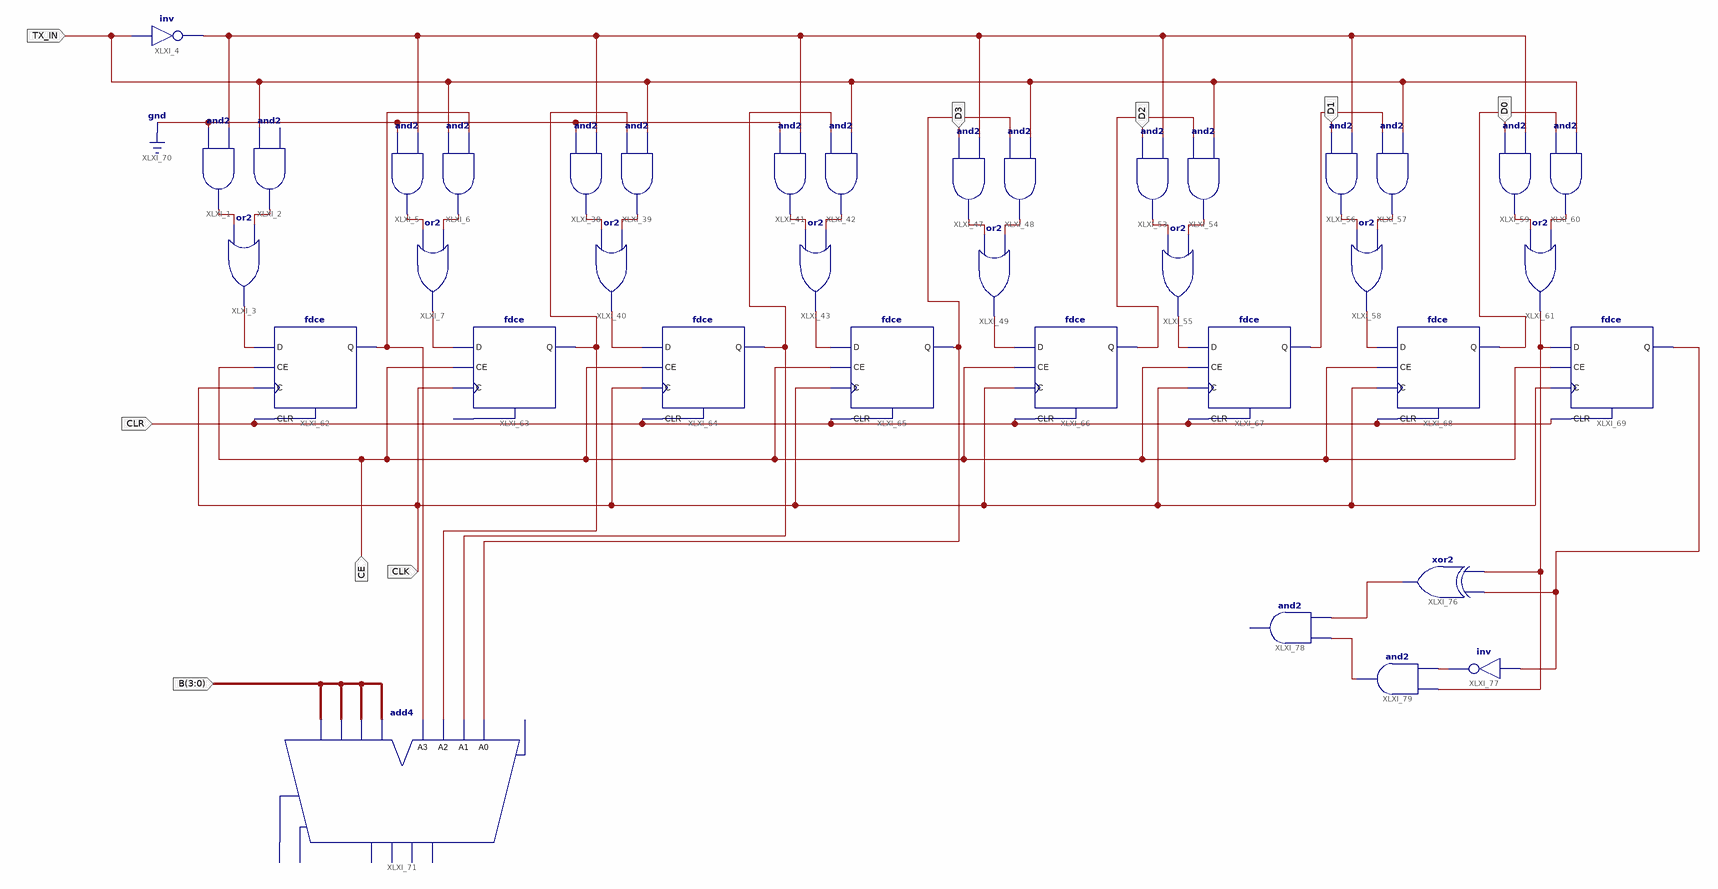
[diagram p0: schematic sheet 1]
// Xilinx ISE schematic Logic_CKT.sch (spartan3e) as structural Verilog: 38 symbols, 9 ports
module Logic_CKT (
  input  TX_IN,
  input  CLK,
  input  D0,
  input  D1,
  input  D2,
  input  D3,
  input  CE,
  input  [3:0] B,
  input  CLR
);

  wire XLXN_1, XLXN_2, XLXN_4, XLXN_5, XLXN_6, XLXN_7, XLXN_8, XLXN_9, XLXN_10, XLXN_11, XLXN_12, XLXN_13,
       XLXN_14, XLXN_15, XLXN_16, XLXN_17, XLXN_18, XLXN_19, XLXN_20, XLXN_21, XLXN_22, XLXN_23, XLXN_24,
       XLXN_25, XLXN_26, XLXN_27, XLXN_33, XLXN_57, XLXN_58, XLXN_59, XLXN_60, XLXN_61, XLXN_84, XLXN_85,
       XLXN_86, XLXN_87;

  and XLXI_1 (XLXN_1, 1'b0, XLXN_33);
  buf XLXI_2 (XLXN_2, TX_IN);  // and2 open: I1
  or XLXI_3 (XLXN_4, XLXN_1, XLXN_2);
  not XLXI_4 (XLXN_33, TX_IN);
  and XLXI_5 (XLXN_5, 1'b0, XLXN_33);
  and XLXI_6 (XLXN_6, TX_IN, XLXN_8);
  or XLXI_7 (XLXN_7, XLXN_5, XLXN_6);
  and XLXI_38 (XLXN_9, 1'b0, XLXN_33);
  and XLXI_39 (XLXN_10, XLXN_11, TX_IN);
  or XLXI_40 (XLXN_61, XLXN_9, XLXN_10);
  and XLXI_41 (XLXN_12, 1'b0, XLXN_33);
  and XLXI_42 (XLXN_13, XLXN_14, TX_IN);
  or XLXI_43 (XLXN_60, XLXN_12, XLXN_13);
  and XLXI_47 (XLXN_15, D3, XLXN_33);
  and XLXI_48 (XLXN_16, XLXN_23, TX_IN);
  or XLXI_49 (XLXN_58, XLXN_15, XLXN_16);
  and XLXI_53 (XLXN_17, D2, XLXN_33);
  and XLXI_54 (XLXN_18, XLXN_24, TX_IN);
  or XLXI_55 (XLXN_59, XLXN_17, XLXN_18);
  and XLXI_56 (XLXN_19, D1, XLXN_33);
  and XLXI_57 (XLXN_20, XLXN_25, TX_IN);
  or XLXI_58 (XLXN_27, XLXN_19, XLXN_20);
  and XLXI_59 (XLXN_21, D0, XLXN_33);
  and XLXI_60 (XLXN_22, XLXN_26, TX_IN);
  or XLXI_61 (XLXN_57, XLXN_21, XLXN_22);
  fdce XLXI_62 (.C(CLK), .CE(CE), .CLR(CLR), .D(XLXN_4), .Q(XLXN_8));
  fdce XLXI_63 (.C(CLK), .CE(CE), .D(XLXN_7), .Q(XLXN_11));  // open: CLR
  fdce XLXI_64 (.C(CLK), .CE(CE), .CLR(CLR), .D(XLXN_61), .Q(XLXN_14));
  fdce XLXI_65 (.C(CLK), .CE(CE), .CLR(CLR), .D(XLXN_60), .Q(XLXN_23));
  fdce XLXI_66 (.C(CLK), .CE(CE), .CLR(CLR), .D(XLXN_58), .Q(XLXN_24));
  fdce XLXI_67 (.C(CLK), .CE(CE), .CLR(CLR), .D(XLXN_59), .Q(XLXN_25));
  fdce XLXI_68 (.C(CLK), .CE(CE), .CLR(CLR), .D(XLXN_27), .Q(XLXN_26));
  fdce XLXI_69 (.C(CLK), .CE(CE), .CLR(CLR), .D(XLXN_57), .Q(XLXN_84));
  add4 XLXI_71 (
    .A0(XLXN_23), .A1(XLXN_14), .A2(XLXN_11), .A3(XLXN_8), .B0(B), .B1(B), .B2(B), .B3(B));  // open: CI, CO, OFL, S0, S1, S2, S3
  xor XLXI_76 (XLXN_87, XLXN_57, XLXN_84);
  not XLXI_77 (XLXN_85, XLXN_84);
  // and2 XLXI_78 has open pins: I0=XLXN_87, I1=XLXN_86, O=open
  and XLXI_79 (XLXN_86, XLXN_85, XLXN_57);
endmodule
